# Altium schematic sheet power_management.SchDoc
size A2
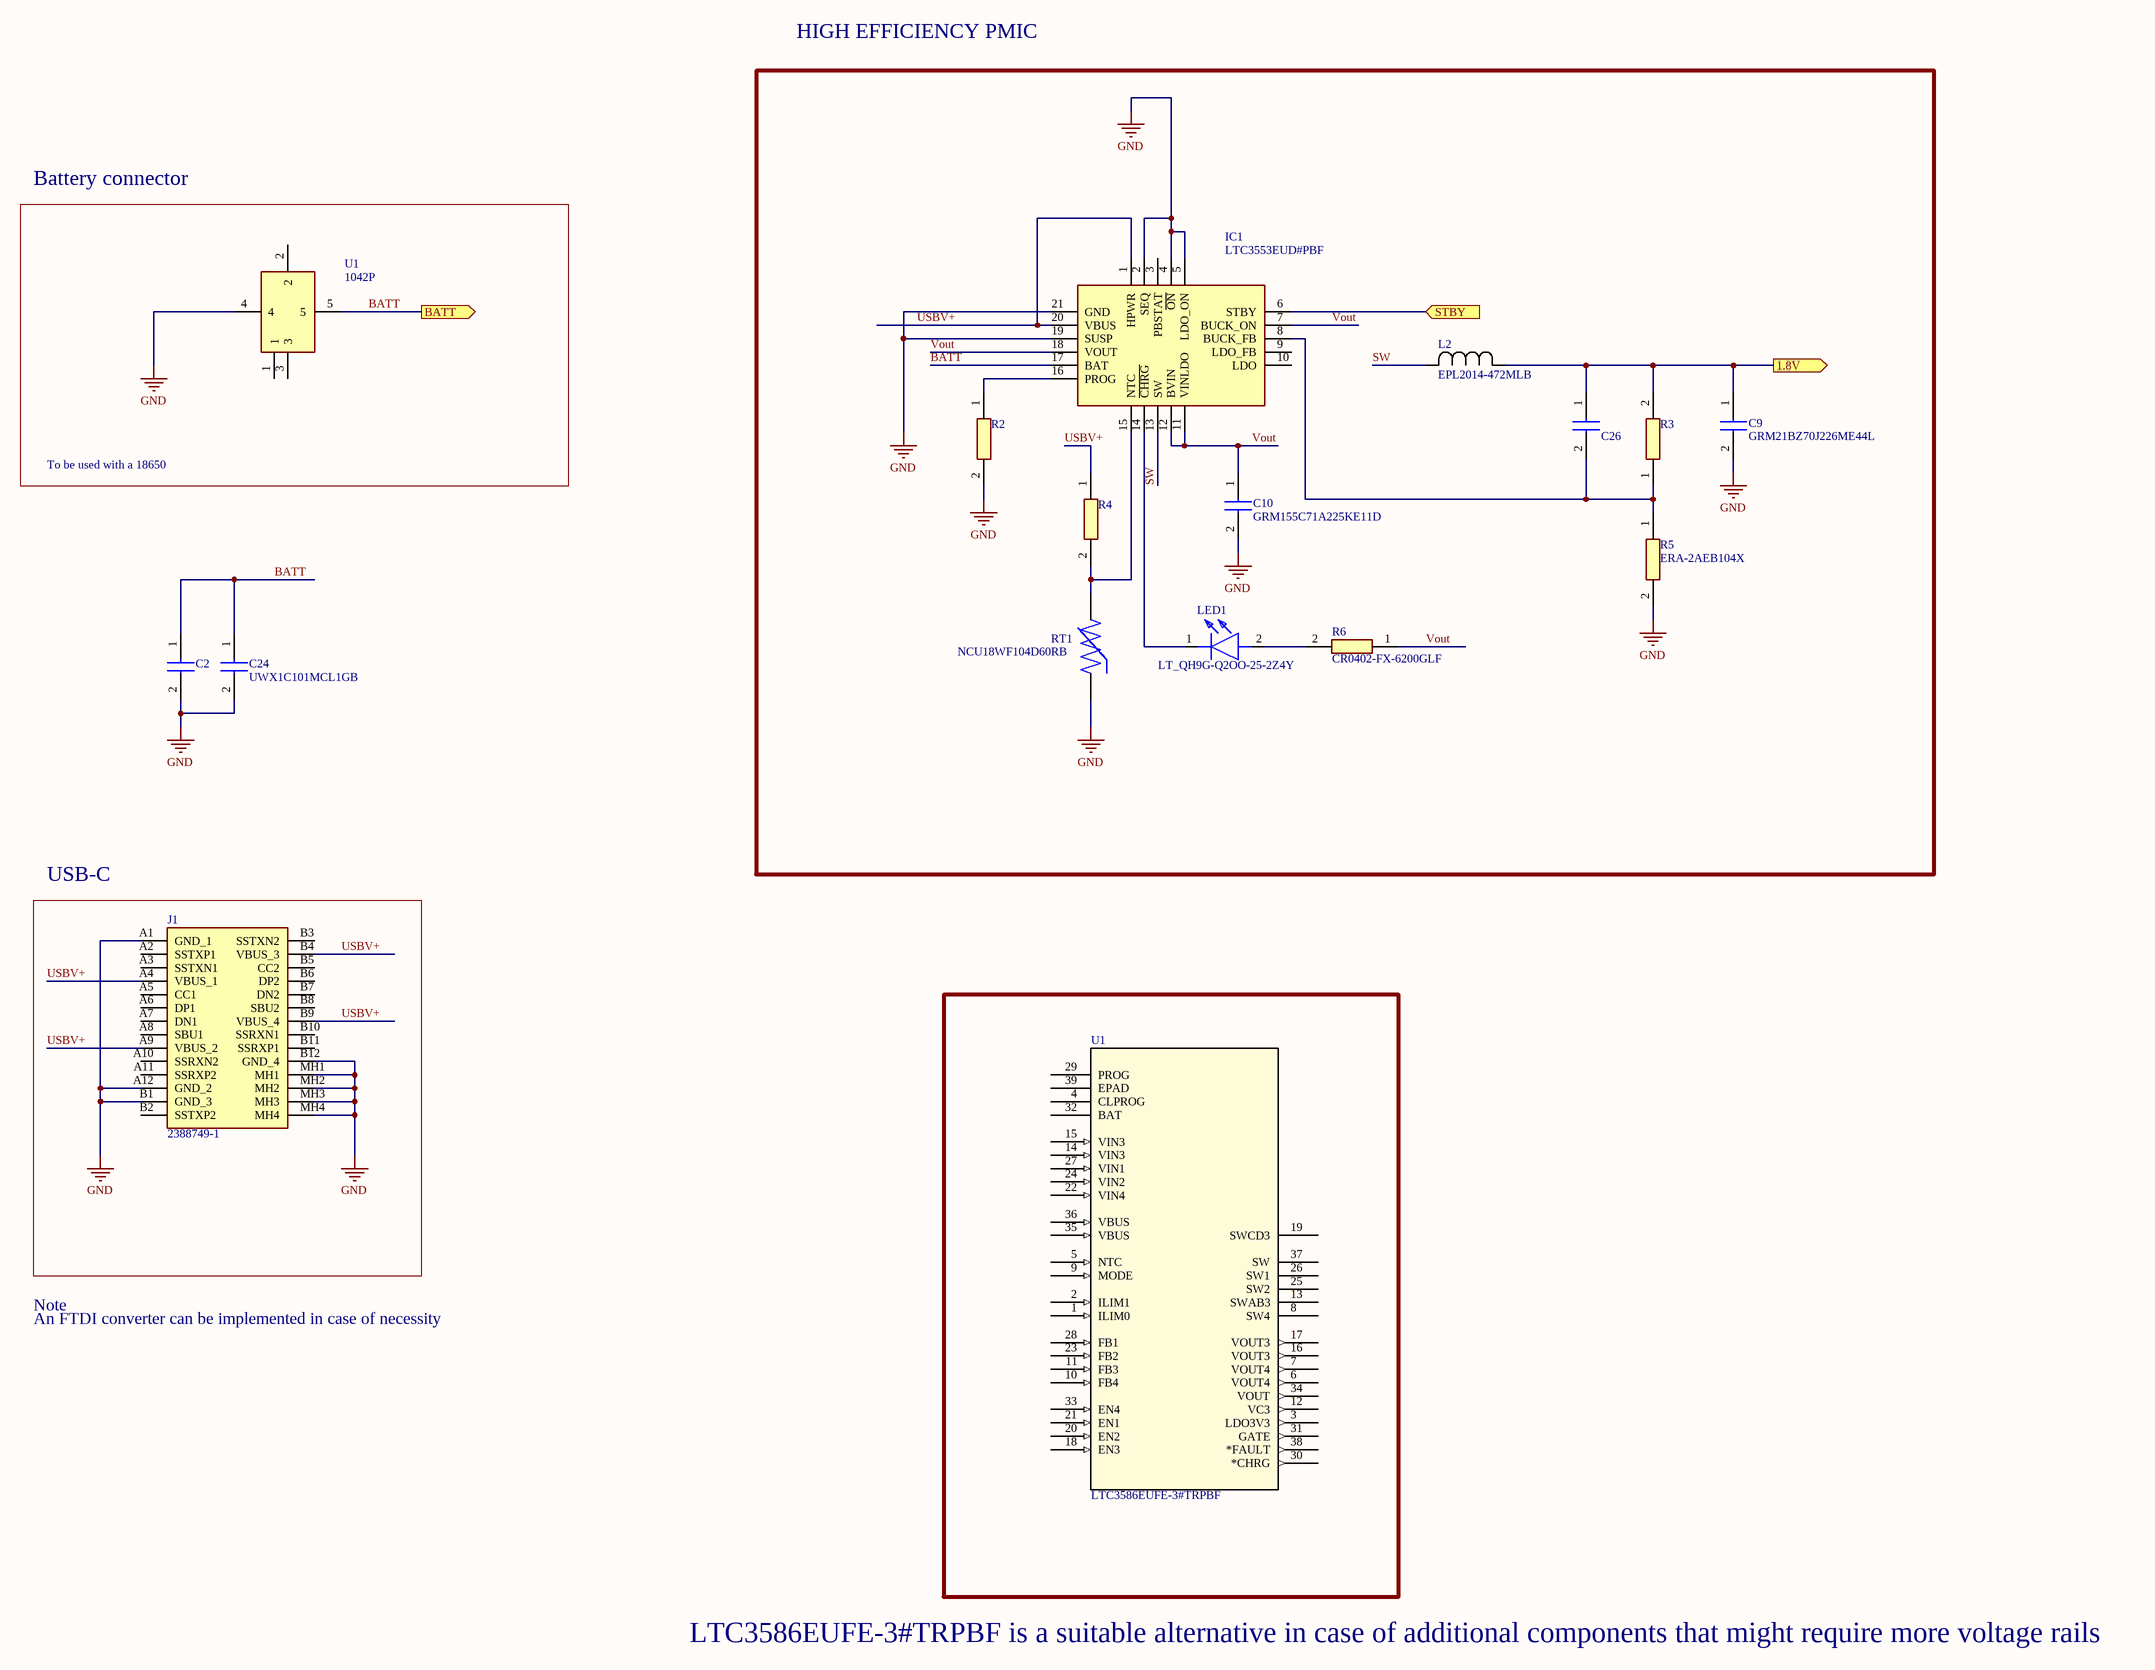
[diagram p0: power_management.SchDoc]

## Parts
(Parts that share a designator on the sheet are numbered #1, #2 ... from top to bottom, then left to right.)
C2  UWX1C101MCL1GB  [WX(6.3)]  (value not drawn)
C9  GRM21BZ70J226ME44L  [CAPC2012X145N]
C10  GRM155C71A225KE11D  [CAPC1005X55N]
C24  UWX1C101MCL1GB  [WX(6.3)]
C26  GRM1555C1H100JA01D  [CAPC1005X55N]  (value not drawn)
IC1  LTC3553EUD#PBF  [QFN40P300X300X80-21N-D]
J1  2388749-1  [23887491]
L2  EPL2014-472MLB  [IND_EPL2014-472MLB_COC]
LED1  LT_QH9G-Q2OO-25-2Z4Y  [LEDC1005X40N]
R2  CR0402-FX-3001GLF  [RESC1005X40N]  (value not drawn)
R3  CPF0402B130KE  [RESC1005X35N]  (value not drawn)
R4  ERJ-2RKF1003X  [ERJ2R_(0402)]  (value not drawn)
R5  ERA-2AEB104X  [ERA2AED122X]
R6  CR0402-FX-6200GLF  [RESC1005X40N]
RT1  NCU18WF104D60RB  [THRMC1608X95N]
U1#1  1042P  [1042P]
U1#2  LTC3586EUFE-3#TRPBF  [QFN-38_UFE_LIT]  (graphical)

## Blocks framed on the sheet
Battery connector: U1#1
USB-C: J1

## Ports
1.8V (out), BATT (out), STBY (in)

## Nets
GND: C2.2(+) C9.2 C10.2 C24.2(+) IC1.2(SEQ) IC1.4(~{ON}) IC1.5(LDO_ON) IC1.19(SUSP) IC1.21(GND) J1.A1(GND_1) J1.A12(GND_2) J1.B1(GND_3) J1.B12(GND_4) J1.MH1 J1.MH2 J1.MH3 J1.MH4 R2.2 R5.2 RT1.1 U1#1.4
1.8V: C9.1 C26.1 L2.1 R3.2 ; port 1.8V
BATT: C2.1(-) C24.1(-) IC1.17(BAT) U1#1.5 ; port BATT
STBY: IC1.6(STBY) ; port STBY
SW: IC1.13(SW) L2.2
USBV+: IC1.1(HPWR) IC1.20(VBUS) J1.A4(VBUS_1) J1.A9(VBUS_2) J1.B4(VBUS_3) J1.B9(VBUS_4) R4.1
Vout: C10.1 IC1.7(BUCK_ON) IC1.11(VINLDO) IC1.12(BVIN) IC1.18(VOUT) R6.1
NetC26_2: C26.2 IC1.8(BUCK_FB) R3.1 R5.1
NetIC1_14: IC1.14(~{CHRG}) LED1.1(K)
NetIC1_15: IC1.15(NTC) R4.2 RT1.2
NetIC1_16: IC1.16(PROG) R2.1
NetLED1_2: LED1.2(A) R6.2

Not connected (* = marked no-connect by the designer): IC1 3(PBSTAT) 9(LDO_FB) 10(LDO); J1 A2(SSTXP1) A3(SSTXN1) A5(CC1) A6(DP1) A7(DN1) A8(SBU1) A10(SSRXN2) A11(SSRXP2) B2(SSTXP2) B3(SSTXN2) B5(CC2) B6(DP2) B7(DN2) B8(SBU2) B10(SSRXN1) B11(SSRXP1); U1#1 1 2 3; U1#2 1(ILIM0) 2(ILIM1) 3(LDO3V3) 4(CLPROG) 5(NTC) 6(VOUT4) 7(VOUT4) 8(SW4) 9(MODE) 10(FB4) 11(FB3) 12(VC3) 13(SWAB3) 14(VIN3) 15(VIN3) 16(VOUT3) 17(VOUT3) 18(EN3) 19(SWCD3) 20(EN2) 21(EN1) 22(VIN4) 23(FB2) 24(VIN2) 25(SW2) 26(SW1) 27(VIN1) 28(FB1) 29(PROG) 30(*CHRG) 31(GATE) 32(BAT) 33(EN4) 34(VOUT) 35(VBUS) 36(VBUS) 37(SW) 38(*FAULT) 39(EPAD)

## Notes on the sheet
- HIGH EFFICIENCY PMIC
- To be used with a 18650
- An FTDI converter can be implemented in case of necessity
- Note
- LTC3586EUFE-3#TRPBF is a suitable alternative in case of additional components that might require more voltage rails
- Title
- Size:
- Date:
- File:
- A2
- Number:
- Time:
- Revision:
- Sheet
- of

## Library data of the parts
C2 C24 = UWX1C101MCL1GB: Capacitor; Manufacturer_Name: Nichicon; Datasheet Link: https://componentsearchengine.com/Datasheets/2/UWX1C101MCL1GB.pdf; Manufacturer_Part_Number: UWX1C101MCL1GB; Mouser Part Number: 647-UWX1C101MCL1; Mouser Price/Stock: https://www.mouser.co.uk/ProductDetail/Nichicon/UWX1C101MCL1GB?qs=7D1LtPJG0i2nFwCSiru1OQ%3D%3D; Arrow Part Number: UWX1C101MCL1GB; Arrow Price/Stock: https://www.arrow.com/en/products/uwx1c101mcl1gb/nichicon?region=nac
C9 = GRM21BZ70J226ME44L: Capacitor; Manufacturer_Name: Murata Electronics; Datasheet Link: https://datasheet.datasheetarchive.com/originals/distributors/Datasheets_SAMA/f9f842f388215b641c6ec7ec92c93a8d.pdf; Height: 1.45mm; Manufacturer_Part_Number: GRM21BZ70J226ME44L; Mouser Part Number: 81-GRM21BZ70J226ME4L; Mouser Price/Stock: https://www.mouser.co.uk/ProductDetail/Murata-Electronics/GRM21BZ70J226ME44L?qs=gt1LBUVyoHk1niSPiXLfGQ%3D%3D; Arrow Part Number: GRM21BZ70J226ME44L; Arrow Price/Stock: https://www.arrow.com/en/products/grm21bz70j226me44l/murata-manufacturing?region=nac
C10 = GRM155C71A225KE11D: Capacitor; Manufacturer_Name: Murata Electronics; Datasheet Link: https://psearch.en.murata.com/capacitor/product/GRM155C71A225KE11%23.html; Height: 0.55mm; Manufacturer_Part_Number: GRM155C71A225KE11D; Mouser Part Number: 81-GRM155C71A225KE1D; Mouser Price/Stock: https://www.mouser.co.uk/ProductDetail/Murata-Electronics/GRM155C71A225KE11D?qs=hNud%2FORuBR1WTMd%2FnRwa3Q%3D%3D; Arrow Part Number: GRM155C71A225KE11D; Arrow Price/Stock: https://www.arrow.com/en/products/grm155c71a225ke11d/murata-manufacturing?region=nac
C26 = GRM1555C1H100JA01D: Capacitor; Manufacturer_Name: Murata Electronics; Datasheet Link: https://datasheet.datasheetarchive.com/originals/distributors/Datasheets_SAMA/ec4f1577dddcc7a13ddad897a28002d3.pdf; Height: 0.55mm; Manufacturer_Part_Number: GRM1555C1H100JA01D; Mouser Part Number: 81-GRM1555C1H100JA1D; Mouser Price/Stock: https://www.mouser.co.uk/ProductDetail/Murata-Electronics/GRM1555C1H100JA01D?qs=to8XolpOzrNUIL4CZ%252BkORA%3D%3D; Arrow Part Number: GRM1555C1H100JA01D; Arrow Price/Stock: https://www.arrow.com/en/products/grm1555c1h100ja01d/murata-manufacturing
IC1 = LTC3553EUD#PBF: Integrated Circuit; Manufacturer_Name: Analog Devices; Datasheet Link: https://www.mouser.com/datasheet/2/609/3553fc-1270248.pdf; Height: 0.8mm; Manufacturer_Part_Number: LTC3553EUD#PBF; Mouser Part Number: 584-LTC3553EUD#PBF; Mouser Price/Stock: https://www.mouser.co.uk/ProductDetail/Analog-Devices/LTC3553EUDPBF?qs=hVkxg5c3xu%252Bt8tpGZUg1fw%3D%3D; Arrow Part Number: LTC3553EUD#PBF; Arrow Price/Stock: https://www.arrow.com/en/products/ltc3553eudpbf/analog-devices
J1 = 2388749-1: Connector; Manufacturer_Name: TE Connectivity; Datasheet Link: https://www.mouser.de/datasheet/2/418/8/ENG_CD_2388749_1-2492255.pdf; Height: 3.29mm; Manufacturer_Part_Number: 2388749-1; Mouser Part Number: 571-2388749-1; Mouser Price/Stock: https://www.mouser.co.uk/ProductDetail/TE-Connectivity/2388749-1?qs=aP1CjGhiNiHDGRk0QZ2ZCg%3D%3D; Arrow Part Number: 2388749-1; Arrow Price/Stock: https://www.arrow.com/en/products/2388749-1/te-connectivity?region=europe
L2 = EPL2014-472MLB: No Description Available; Mfr_Name: Coilcraft; Type: DEV; Copyright: Copyright (C) 2022 Ultra Librarian. All rights reserved.; Manufacturer_Part_Number: EPL2014-472MLB; RefDes: RefDes
LED1 = LT_QH9G-Q2OO-25-2Z4Y: LED; Manufacturer_Name: OSRAM; Manufacturer_Part_Number: LT QH9G-Q2OO-25-2Z4Y; Datasheet Link: https://dammedia.osram.info/media/resource/hires/osram-dam-5171475/LT%20QH9G_EN.pdf; Height: 0.4mm; Mouser Part Number: 720-LTQH9GQ2S225; Mouser Price/Stock: https://www.mouser.co.uk/ProductDetail/OSRAM-Opto-Semiconductors/LT-QH9G-Q2OO-25-2Z4Y?qs=74fRo9GAWsyBNNbbi2bfww%3D%3D; Arrow Part Number: LT QH9G-Q2OO-25-2Z4Y; Arrow Price/Stock: https://www.arrow.com/en/products/ltqh9g-q2oo-25-2z4y/osram-opto-semiconductors
R2 = CR0402-FX-3001GLF: Resistor; Manufacturer_Name: Bourns; Datasheet Link: https://www.bourns.com/pdfs/CR0402.pdf; Height: 0.4mm; Manufacturer_Part_Number: CR0402-FX-3001GLF; Mouser Part Number: 652-CR0402FX-3001GLF; Mouser Price/Stock: https://www.mouser.co.uk/ProductDetail/Bourns/CR0402-FX-3001GLF?qs=SFHnMgm9IsyiPGXk%2Fs2PYg%3D%3D
R3 = CPF0402B130KE: Resistor; Manufacturer_Name: TE Connectivity; Datasheet Link: http://www.farnell.com/datasheets/1786775.pdf; Height: 0.35mm; Manufacturer_Part_Number: CPF0402B130KE; Mouser Part Number: 279-CPF0402B130KE; Mouser Price/Stock: https://www.mouser.com/Search/Refine.aspx?Keyword=279-CPF0402B130KE
R4 = ERJ-2RKF1003X: Resistor; Manufacturer_Name: Panasonic; Datasheet Link: http://industrial.panasonic.com/cdbs/www-data/pdf/RDA0000/AOA0000C304.pdf; Height: 0.4mm; Manufacturer_Part_Number: ERJ-2RKF1003X; Mouser Part Number: 667-ERJ-2RKF1003X; Mouser Price/Stock: https://www.mouser.co.uk/ProductDetail/Panasonic/ERJ-2RKF1003X?qs=H7k1u0Mp9JQnXoBKdf15Qg%3D%3D; Arrow Part Number: ERJ-2RKF1003X; Arrow Price/Stock: https://www.arrow.com/en/products/erj-2rkf1003x/panasonic?region=nac
R5 = ERA-2AEB104X: Resistor; Manufacturer_Name: Panasonic; Datasheet Link: http://industrial.panasonic.com/cdbs/www-data/pdf/RDM0000/AOA0000C307.pdf; Height: 0.4mm; Manufacturer_Part_Number: ERA-2AEB104X; Mouser Part Number: 667-ERA-2AEB104X; Mouser Price/Stock: https://www.mouser.co.uk/ProductDetail/Panasonic/ERA-2AEB104X?qs=YFwoyZoVY0jijibKYIWHHg%3D%3D; Arrow Part Number: ERA-2AEB104X; Arrow Price/Stock: https://www.arrow.com/en/products/era-2aeb104x/panasonic
R6 = CR0402-FX-6200GLF: Resistor; Manufacturer_Name: Bourns; Datasheet Link: https://www.bourns.com/pdfs/CR0402.pdf; Height: 0.4mm; Manufacturer_Part_Number: CR0402-FX-6200GLF; Mouser Part Number: 652-CR0402FX-6200GLF; Mouser Price/Stock: https://www.mouser.co.uk/ProductDetail/Bourns/CR0402-FX-6200GLF?qs=ePR1ZvdkOKK%252BzBZSL76wNw%3D%3D; Arrow Part Number: CR0402-FX-6200GLF; Arrow Price/Stock: https://www.arrow.com/en/products/cr0402-fx-6200glf/bourns?region=nac
RT1 = NCU18WF104D60RB: NTC Thermistor 100k 0603 (1608 Metric); MF: Murata; Package: 1608 Murata; MP: NCU18WF104D60RB; Check_prices: https://www.snapeda.com/parts/NCU18WF104D60RB/Murata/view-part/1297311/?ref=eda; Digi-Key_Part_Number: 490-18157-1-ND; Purchase-URL: https://pricing.snapeda.com/search/part/NCU18WF104D60RB/?ref=eda; Value: *; SnapEDA_Link: https://www.snapeda.com/parts/NCU18WF104D60RB/Murata/view-part/1297311/?ref=snap
U1#1 = 1042P: Undefined or Miscellaneous; Manufacturer_Name: Keystone Electronics; Datasheet Link: http://www.keyelco.com/product-pdf.cfm?p=13957; Height: 14mm; Manufacturer_Part_Number: 1042P; Mouser Part Number: 534-1042P; Mouser Price/Stock: https://www.mouser.co.uk/ProductDetail/Keystone-Electronics/1042P?qs=g2rIOKKlpoboHyq0g1zn1A%3D%3D; Arrow Part Number: 1042P; Arrow Price/Stock: https://www.arrow.com/en/products/1042p/keystone-electronics?region=europe
U1#2 = LTC3586EUFE-3#TRPBF: No Description Available; Mfr_Name: Analog Devices Inc; Copyright: Copyright (C) 2022 Ultra Librarian. All rights reserved.; Manufacturer_Part_Number: LTC3586EUFE-3#TRPBF; RefDes: RefDes; Type: DEV